# Altium project GMAX4651_MB.PrjPcb
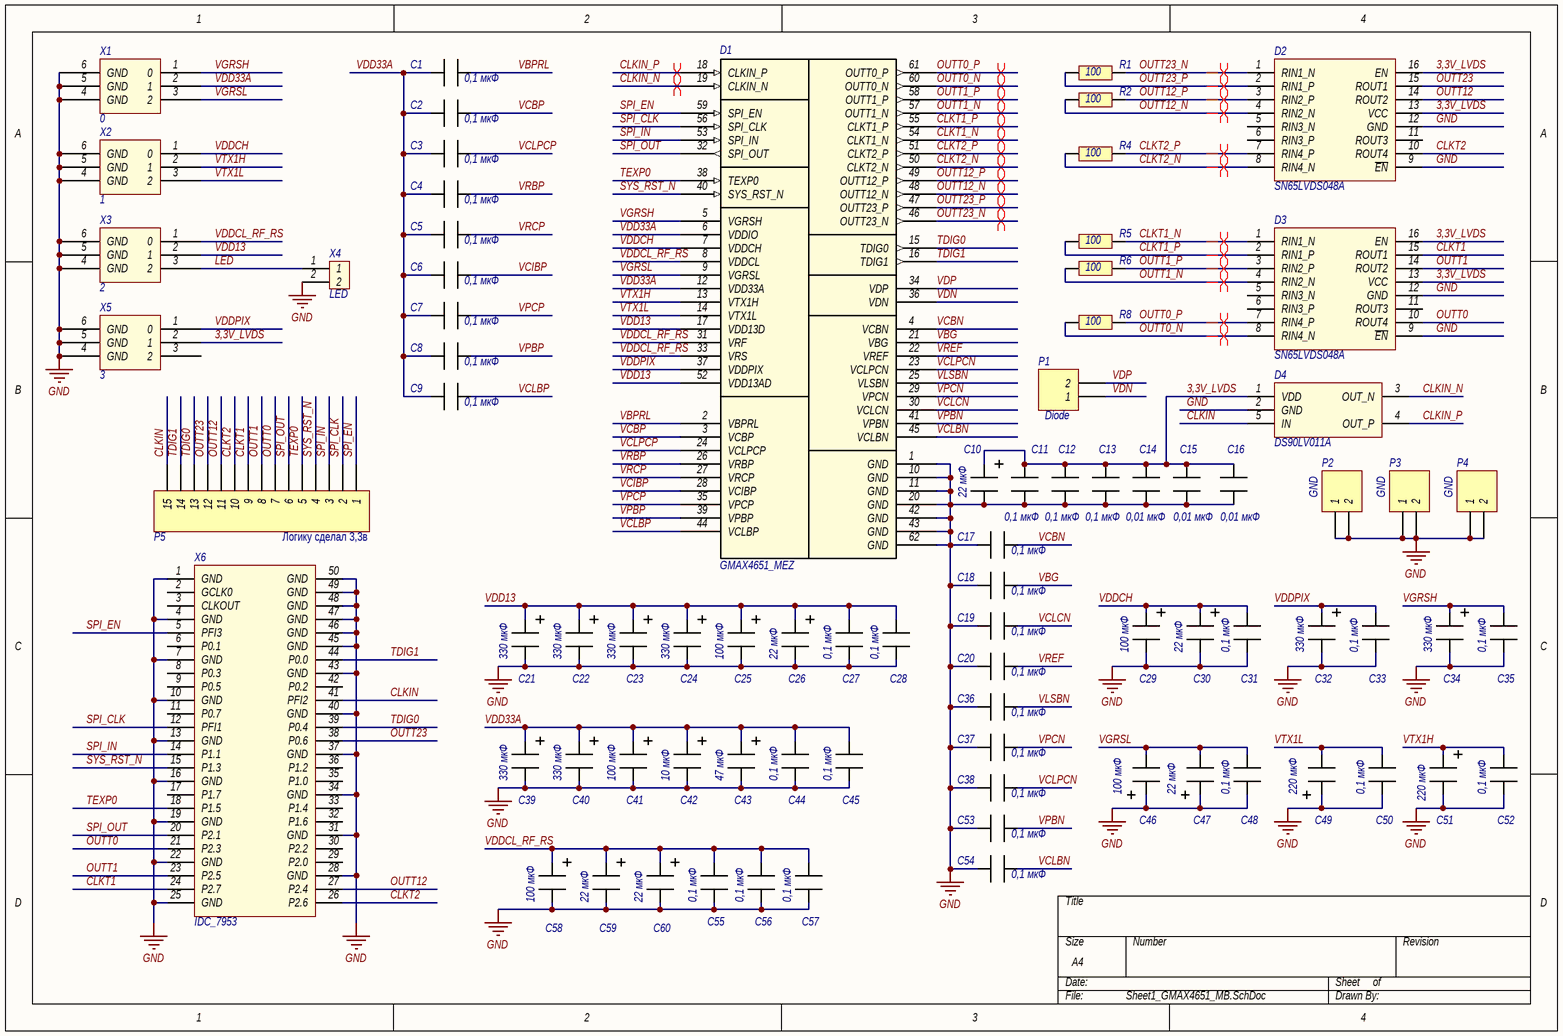
[diagram p0: Sheet1_GMAX4651_MB.SchDoc]
1 sheet, 81 parts. Net scope: global (net labels, ports and power ports of the same name join across sheets).
Board file: GMAX4651_MB.PcbDoc

## Sheet Sheet1_GMAX4651_MB.SchDoc
size A4; SheetNumber: 1; SheetTotal: 1

### Parts
C1  0,1 мкФ  [CAP_SMALL]
C2  0,1 мкФ  [CAP_SMALL]
C3  0,1 мкФ  [CAP_SMALL]
C4  0,1 мкФ  [CAP_SMALL]
C5  0,1 мкФ  [CAP_SMALL]
C6  0,1 мкФ  [CAP_SMALL]
C7  0,1 мкФ  [CAP_SMALL]
C8  0,1 мкФ  [CAP_SMALL]
C9  0,1 мкФ  [CAP_SMALL]
C10  22 мкФ  [Cap_0511_electrolitic]
C11  0,1 мкФ  [CAP_SMALL]
C12  0,1 мкФ  [CAP_SMALL]
C13  0,1 мкФ  [CAP_SMALL]
C14  0,01 мкФ  [CAP_SMALL]
C15  0,01 мкФ  [CAP_SMALL]
C16  0,01 мкФ  [CAP_SMALL]
C17  0,1 мкФ  [CAP_SMALL]
C18  0,1 мкФ  [CAP_SMALL]
C19  0,1 мкФ  [CAP_SMALL]
C20  0,1 мкФ  [CAP_SMALL]
C21  330 мкФ  [Cap_1013_electrolitic]
C22  330 мкФ  [Cap_1013_electrolitic]
C23  330 мкФ  [Cap_1013_electrolitic]
C24  330 мкФ  [Cap_1013_electrolitic]
C25  100 мкФ  [Cap_0612_electrolitic]
C26  22 мкФ  [Cap_0511_electrolitic]
C27  0,1 мкФ  [CAP_SMALL]
C28  0,1 мкФ  [CAP_SMALL]
C29  100 мкФ  [Cap_0612_electrolitic]
C30  22 мкФ  [Cap_0511_electrolitic]
C31  0,1 мкФ  [CAP_SMALL]
C32  330 мкФ  [Cap_1013_electrolitic]
C33  0,1 мкФ  [CAP_SMALL]
C34  330 мкФ  [Cap_1013_electrolitic]
C35  0,1 мкФ  [CAP_SMALL]
C36  0,1 мкФ  [CAP_SMALL]
C37  0,1 мкФ  [CAP_SMALL]
C38  0,1 мкФ  [CAP_SMALL]
C39  330 мкФ  [Cap_1013_electrolitic]
C40  330 мкФ  [Cap_1013_electrolitic]
C41  100 мкФ  [Cap_0612_electrolitic]
C42  10 мкФ  [Cap_0511_electrolitic]
C43  47 мкФ  [Cap_0612_electrolitic]
C44  0,1 мкФ  [CAP_SMALL]
C45  0,1 мкФ  [CAP_SMALL]
C46  100 мкФ  [Cap_0612_electrolitic]
C47  22 мкФ  [Cap_0511_electrolitic]
C48  0,1 мкФ  [CAP_SMALL]
C49  220 мкФ  [Cap_1013_electrolitic]
C50  0,1 мкФ  [CAP_SMALL]
C51  220 мкФ  [Cap_1013_electrolitic]
C52  0,1 мкФ  [CAP_SMALL]
C53  0,1 мкФ  [CAP_SMALL]
C54  0,1 мкФ  [CAP_SMALL]
C55  0,1 мкФ  [CAP_SMALL]
C56  0,1 мкФ  [CAP_SMALL]
C57  0,1 мкФ  [CAP_SMALL]
C58  100 мкФ  [Cap_0612_electrolitic]
C59  22 мкФ  [Cap_0511_electrolitic]
C60  22 мкФ  [Cap_0511_electrolitic]
D1  GMAX4651_MEZ  [GMAX4651_MEZ]
D2  SN65LVDS048A  [SN65LVDS048A (4LVDS)]
D3  SN65LVDS048A  [SN65LVDS048A (4LVDS)]
D4  DS90LV011A  [DS90LV011A]
P1  Diode  [HDR1X2]
P2  GND  [HDR1X2]
P3  GND  [HDR1X2]
P4  GND  [HDR1X2]
P5  Header 15  [HDR1X15]  (value not drawn)
R1  100  [RES]
R2  100  [RES]
R4  100  [RES]
R5  100  [RES]
R6  100  [RES]
R8  100  [RES]
X1  0  [POWER]
X2  1  [POWER]
X3  2  [POWER]
X4  LED  [KLEMMNIK_2]
X5  3  [POWER]
X6  IDC_7953  [IDC_7953]

### Nets
GND: C10.2 C11.1 C12.1 C13.1 C14.1 C15.1 C16.1 C17.2 C18.2 C19.2 C20.2 C21.2 C22.2 C23.2 C24.2 C25.2 C26.2 C27.2 C28.2 C29.2 C30.2 C31.2 C32.2 C33.2 C34.2 C35.2 C36.2 C37.2 C38.2 C39.2 C40.2 C41.2 C42.2 C43.2 C44.2 C45.2 C46.1 C47.1 C48.2 C49.1 C50.2 C51.2 C52.2 C53.2 C54.2 C55.2 C56.2 C57.2 C58.2 C59.2 C60.2 D1.1(GND) D1.10(GND) D1.11(GND) D1.20(GND) D1.42(GND) D1.43(GND) D1.62(GND) D2.9(~{EN}) D2.12(GND) D3.9(~{EN}) D3.12(GND) D4.2(GND) P2.1 P2.2 P3.1 P3.2 P4.1 P4.2 X1.4(GND) X1.5(GND) X1.6(GND) X2.4(GND) X2.5(GND) X2.6(GND) X3.4(GND) X3.5(GND) X3.6(GND) X4.2 X5.4(GND) X5.5(GND) X5.6(GND) X6.1(GND) X6.4(GND) X6.7(GND) X6.10(GND) X6.13(GND) X6.16(GND) X6.19(GND) X6.22(GND) X6.25(GND) X6.28(GND) X6.31(GND) X6.34(GND) X6.37(GND) X6.40(GND) X6.43(GND) X6.45(GND) X6.46(GND) X6.47(GND) X6.48(GND) X6.49(GND) X6.50(GND)
3,3V_LVDS: C10.1 C11.2 C12.2 C13.2 C14.2 C15.2 C16.2 D2.13(VCC) D2.16(EN) D3.13(VCC) D3.16(EN) D4.1(VDD) X5.2(1)
CLKIN: D4.5(IN) P5.15 X6.41(PFI2)
CLKIN_N: D1.19(CLKIN_N) D4.3(OUT_N)
CLKIN_P: D1.18(CLKIN_P) D4.4(OUT_P)
CLKT1: D3.15(ROUT1) P5.9 X6.24(P2.7)
CLKT1_N: D1.54(CLKT1_N) D3.1(RIN1_N) R5.1
CLKT1_P: D1.55(CLKT1_P) D3.2(RIN1_P) R5.2
CLKT2: D2.10(ROUT4) P5.10 X6.26(P2.6)
CLKT2_N: D1.50(CLKT2_N) D2.8(RIN4_N) R4.2
CLKT2_P: D1.51(CLKT2_P) D2.7(RIN4_P) R4.1
LED: X3.3(2) X4.1
OUTT0: D3.10(ROUT4) P5.7 X6.21(P2.3)
OUTT0_N: D1.60(OUTT0_N) D3.8(RIN4_N) R8.2
OUTT0_P: D1.61(OUTT0_P) D3.7(RIN4_P) R8.1
OUTT1: D3.14(ROUT2) P5.8 X6.23(P2.5)
OUTT1_N: D1.57(OUTT1_N) D3.4(RIN2_N) R6.2
OUTT1_P: D1.58(OUTT1_P) D3.3(RIN2_P) R6.1
OUTT12: D2.14(ROUT2) P5.11 X6.27(P2.4)
OUTT12_N: D1.48(OUTT12_N) D2.4(RIN2_N) R2.2
OUTT12_P: D1.49(OUTT12_P) D2.3(RIN2_P) R2.1
OUTT23: D2.15(ROUT1) P5.12 X6.38(P0.6)
OUTT23_N: D1.46(OUTT23_N) D2.1(RIN1_N) R1.1
OUTT23_P: D1.47(OUTT23_P) D2.2(RIN1_P) R1.2
SPI_CLK: D1.56(SPI_CLK) P5.2 X6.12(PFI1)
SPI_EN: D1.59(SPI_EN) P5.1 X6.5(PFI3)
SPI_IN: D1.53(SPI_IN) P5.3 X6.14(P1.1)
SPI_OUT: D1.32(SPI_OUT) P5.6 X6.20(P2.1)
SYS_RST_N: D1.40(SYS_RST_N) P5.4 X6.15(P1.3)
TDIG0: D1.15(TDIG0) P5.13 X6.39(P0.4)
TDIG1: D1.16(TDIG1) P5.14 X6.44(P0.0)
TEXP0: D1.38(TEXP0) P5.5 X6.18(P1.5)
VBG: C18.1 D1.21(VBG)
VBPRL: C1.1 D1.2(VBPRL)
VCBN: C17.1 D1.4(VCBN)
VCBP: C2.1 D1.3(VCBP)
VCIBP: C6.1 D1.28(VCIBP)
VCLBN: C54.1 D1.45(VCLBN)
VCLBP: C9.1 D1.44(VCLBP)
VCLCN: C19.1 D1.30(VCLCN)
VCLPCN: C38.1 D1.23(VCLPCN)
VCLPCP: C3.1 D1.24(VCLPCP)
VDD13: C21.1 C22.1 C23.1 C24.1 C25.1 C26.1 C27.1 C28.1 D1.17(VDD13D) D1.52(VDD13AD) X3.2(1)
VDD33A: C1.2 C2.2 C3.2 C4.2 C5.2 C6.2 C7.2 C8.2 C9.2 C39.1 C40.1 C41.1 C42.1 C43.1 C44.1 C45.1 D1.6(VDDIO) D1.12(VDD33A) X1.2(1)
VDDCH: C29.1 C30.1 C31.1 D1.7(VDDCH) X2.1(0)
VDDCL_RF_RS: C55.1 C56.1 C57.1 C58.1 C59.1 C60.1 D1.8(VDDCL) D1.31(VRF) D1.33(VRS) X3.1(0)
VDDPIX: C32.1 C33.1 D1.37(VDDPIX) X5.1(0)
VDN: D1.36(VDN) P1.1
VDP: D1.34(VDP) P1.2
VGRSH: C34.1 C35.1 D1.5(VGRSH) X1.1(0)
VGRSL: C46.2 C47.2 C48.1 D1.9(VGRSL) X1.3(2)
VLSBN: C36.1 D1.25(VLSBN)
VPBN: C53.1 D1.41(VPBN)
VPBP: C8.1 D1.39(VPBP)
VPCN: C37.1 D1.29(VPCN)
VPCP: C7.1 D1.35(VPCP)
VRBP: C4.1 D1.26(VRBP)
VRCP: C5.1 D1.27(VRCP)
VREF: C20.1 D1.22(VREF)
VTX1H: C51.1 C52.1 D1.13(VTX1H) X2.2(1)
VTX1L: C49.2 C50.1 D1.14(VTX1L) X2.3(2)

Not connected (* = marked no-connect by the designer): D2 5(RIN3_N) 6(RIN3_P) 11(ROUT3); D3 5(RIN3_N) 6(RIN3_P) 11(ROUT3); X5 3(2); X6 2(GCLK0) 3(CLKOUT) 6(P0.1) 8(P0.3) 9(P0.5) 11(P0.7) 17(P1.7) 29(P2.0) 30(P2.2) 32(P1.6) 33(P1.4) 35(P1.0) 36(P1.2) 42(P0.2)

### Layout directives
differential pair: CLKIN_N, CLKIN_P, CLKT1_N, CLKT1_P, CLKT2_N, CLKT2_P, OUTT0_N, OUTT0_P, OUTT1_N, OUTT1_P, OUTT12_N, OUTT12_P, OUTT23_N, OUTT23_P

### Notes on the sheet
- Логику сделал 3,3в

### Library data of the parts
C1-C9 C11-C20 C27 C28 C31 C33 C35-C38 C44 C45 C48 C50 C52-C57 = CAP_SMALL
C10 C26 C30 C42 C47 C59 C60 = Cap_electrolotoc_0511
C21-C24 C32 C34 C39 C40 C49 C51 = Cap_electrolotoc_1013
C25 C29 C41 C43 C46 C58 = Cap_electrolotoc_0612
D2 D3 = SN65LVDS048A (4LVDS)
D4 = DS90LV011A: LVDS Driver 1 ch
P1-P4 = Header 2: Header, 2-Pin; LatestRevisionDate: 17-Jul-2002; LatestRevisionNote: Re-released for DXP Platform.; Publisher: Altium Limited
P5 = Header 15: Header, 15-Pin; LatestRevisionDate: 17-Jul-2002; LatestRevisionNote: Re-released for DXP Platform.; Publisher: Altium Limited
R1 R2 R4-R6 R8 = RES
X1-X3 X5 = POWER
X4 = KLEMMNIK_2